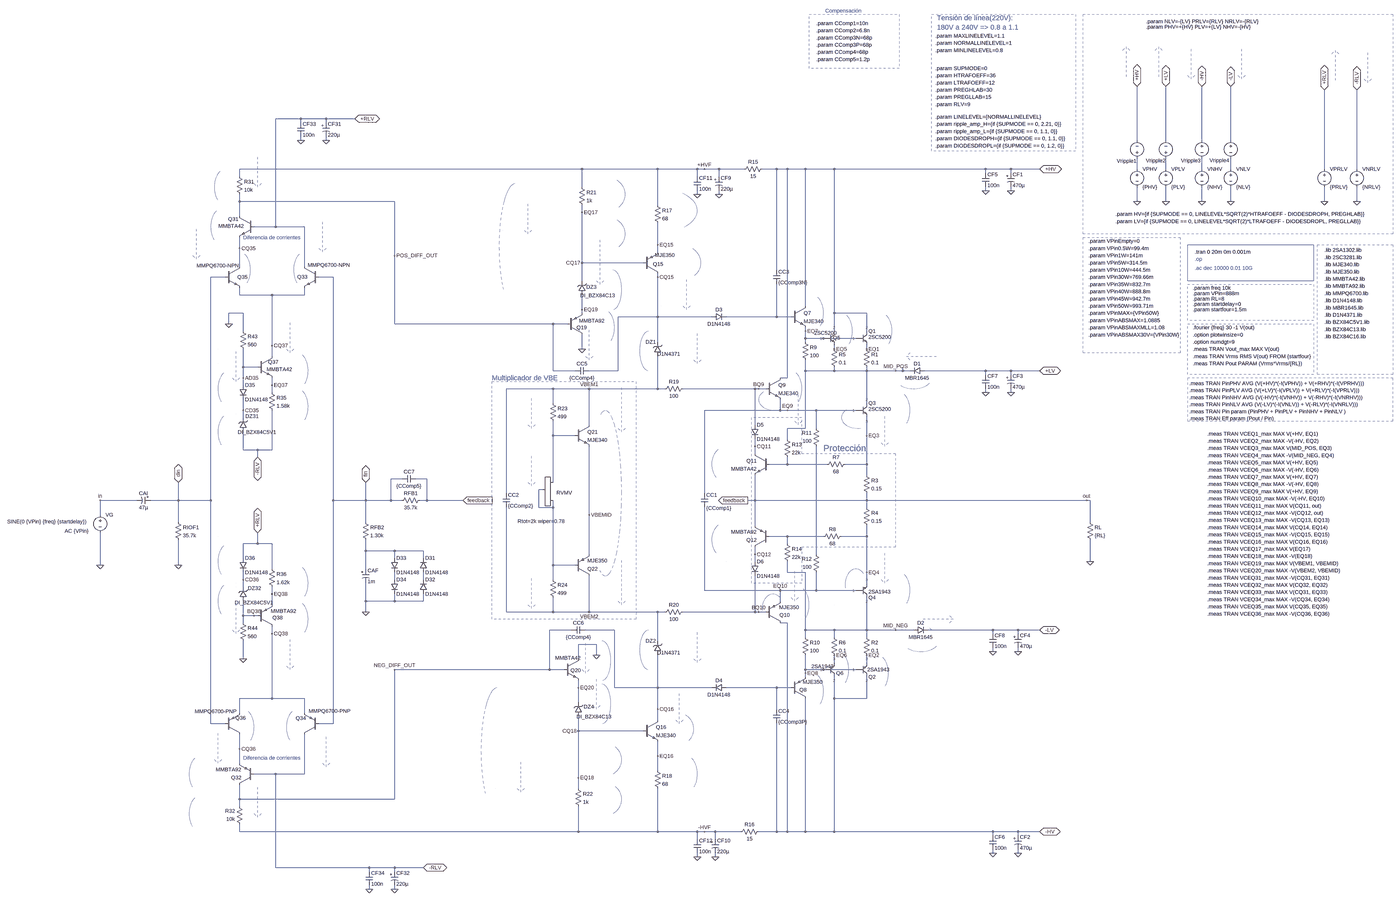
[diagram p0: schematic amplifier_V2.0c.asc, whole sheet]
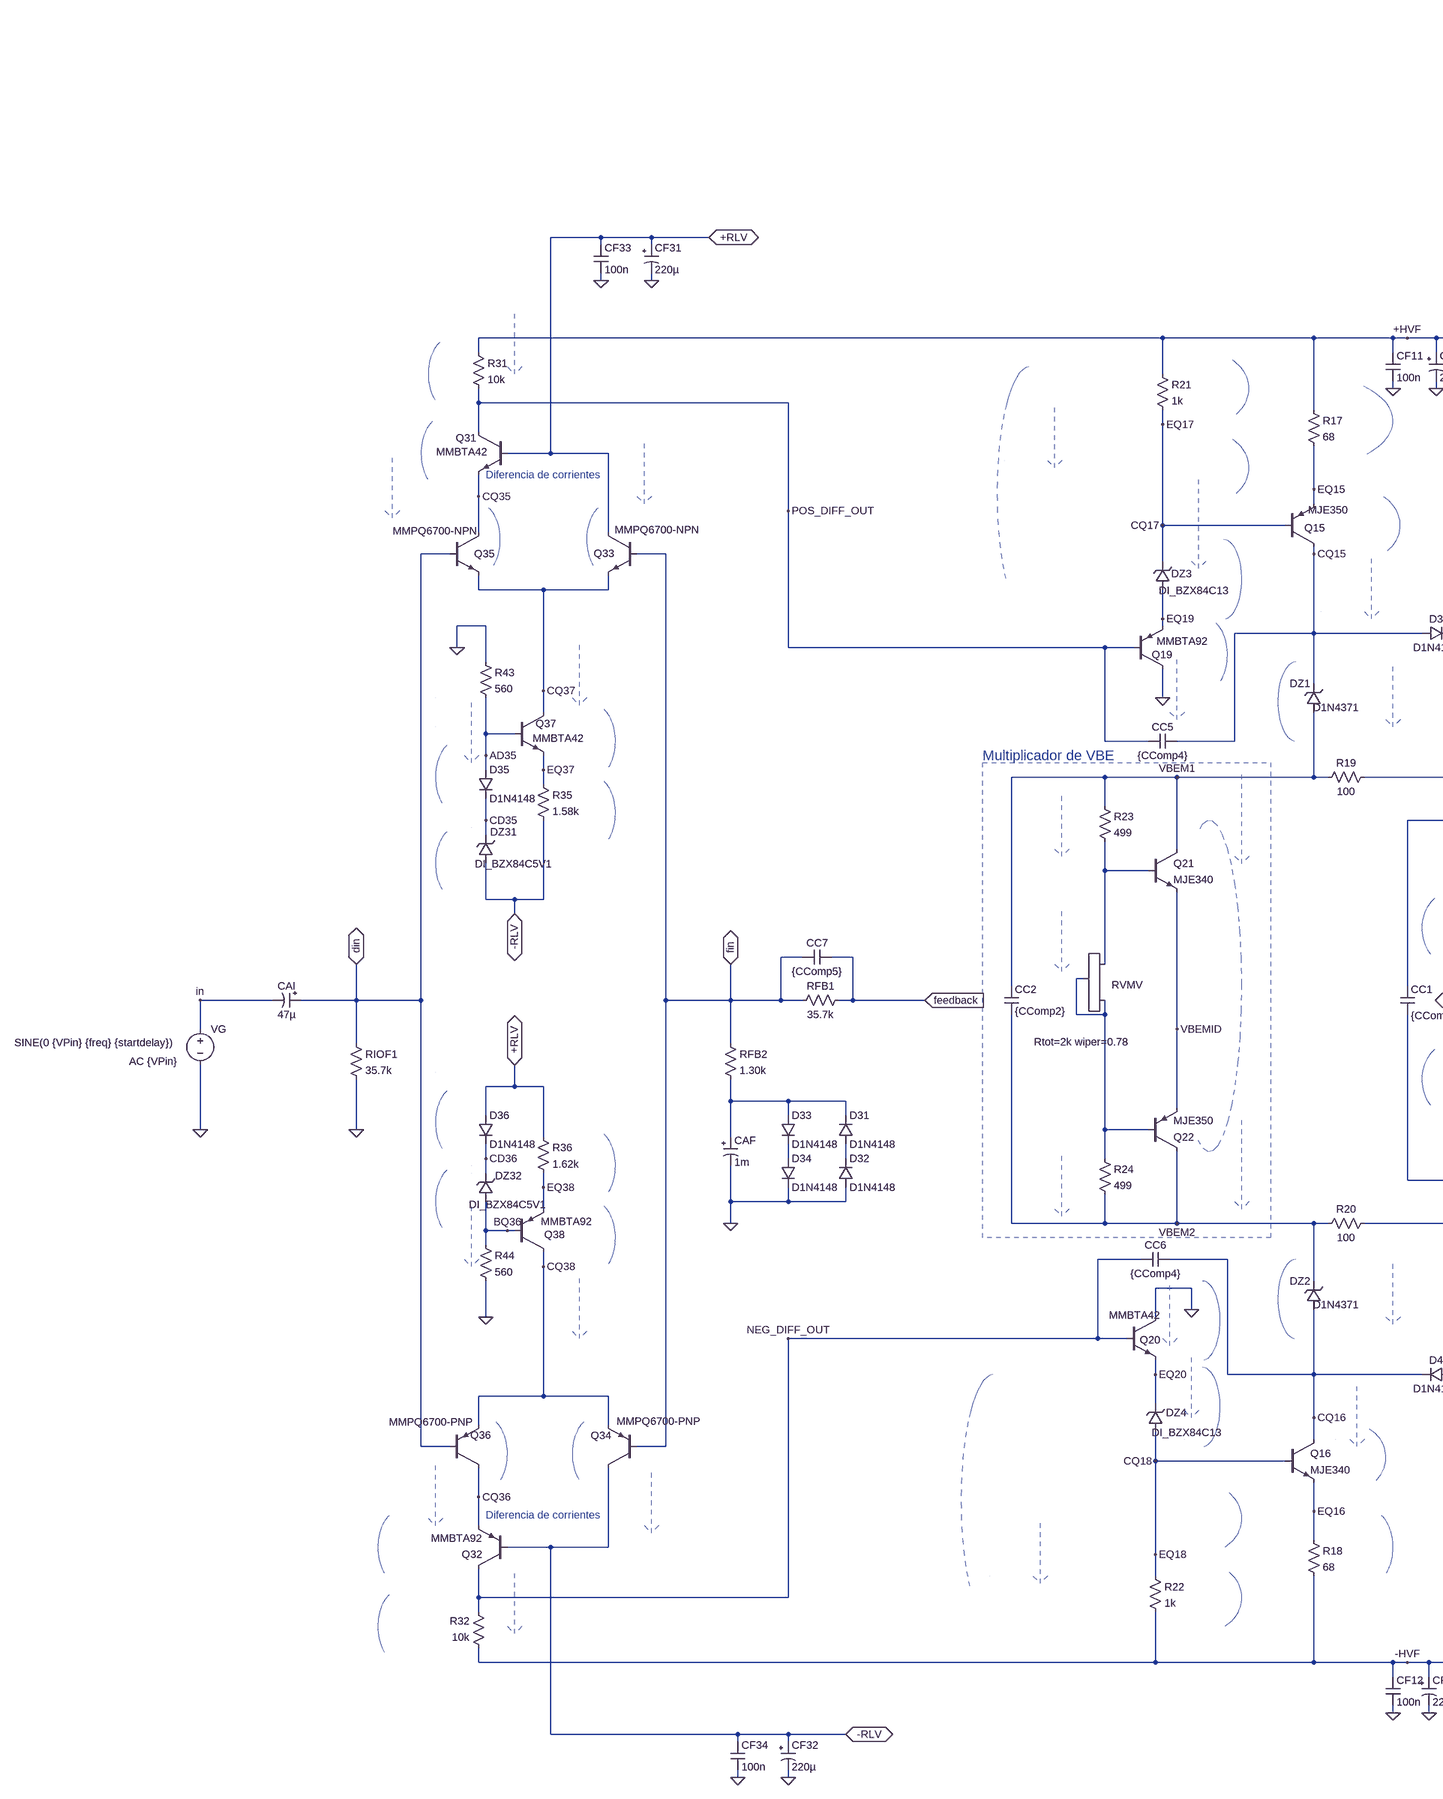
[diagram p1: schematic amplifier_V2.0c.asc, part, row 1 of 1, column 1 of 2]
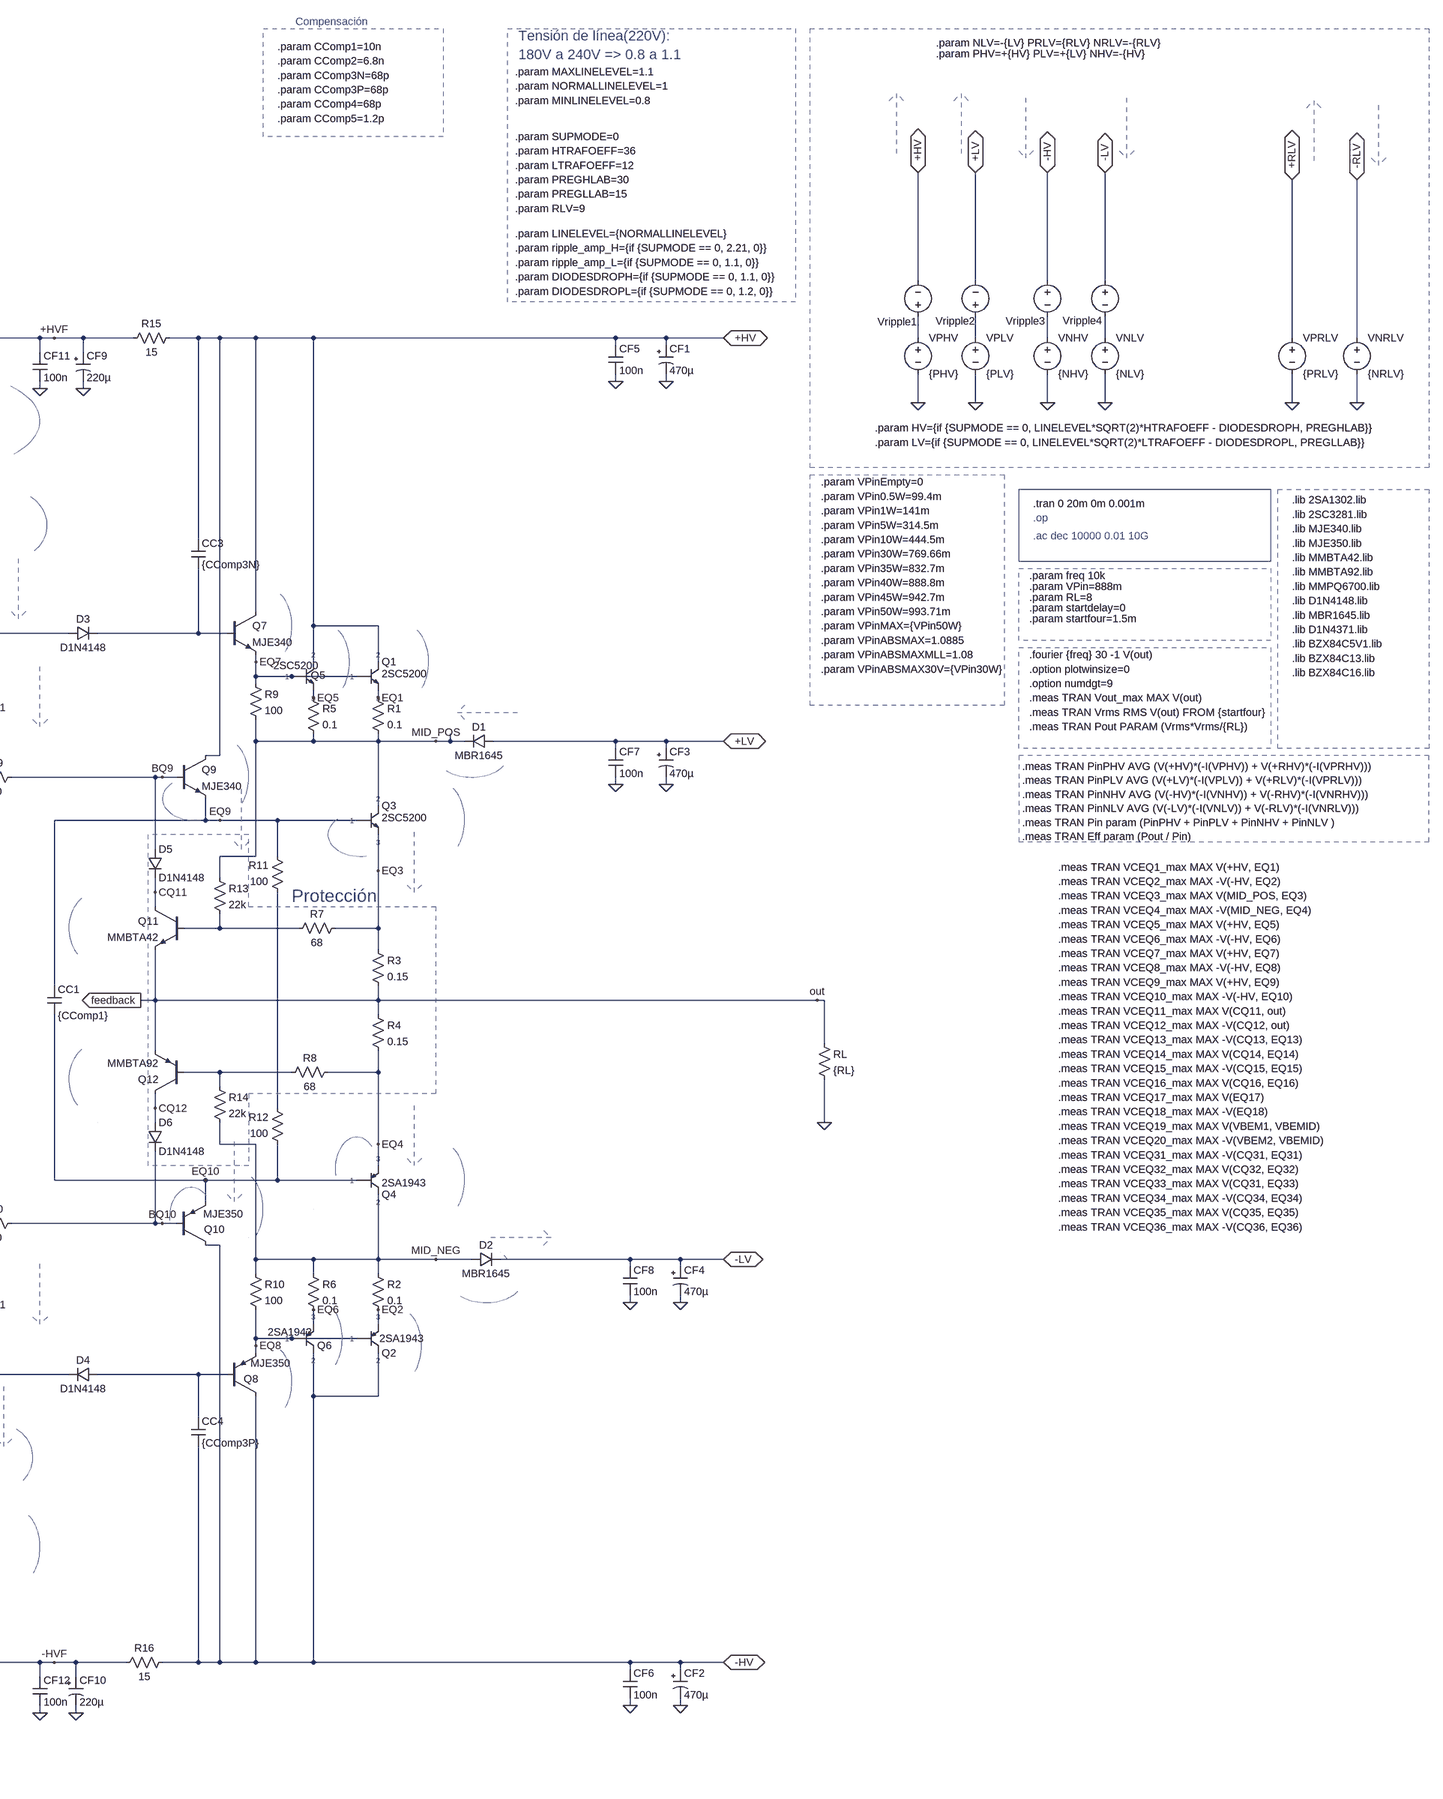
[diagram p2: schematic amplifier_V2.0c.asc, part, row 1 of 1, column 2 of 2]
amplifier_V2.0c.asc, the LTspice schematic file:
Version 4
SHEET 1 4212 2620
WIRE -1888 -1568 -2000 -1568
WIRE -1776 -1568 -1888 -1568
WIRE -1648 -1568 -1776 -1568
WIRE -1888 -1552 -1888 -1568
WIRE -1776 -1552 -1776 -1568
WIRE -1888 -1472 -1888 -1488
WIRE -1776 -1472 -1776 -1488
WIRE 1824 -1472 1824 -1712
WIRE 1952 -1472 1952 -1712
WIRE 2112 -1472 2112 -1712
WIRE 2240 -1472 2240 -1712
WIRE -640 -1344 -2160 -1344
WIRE -304 -1344 -640 -1344
WIRE -128 -1344 -304 -1344
WIRE -96 -1344 -128 -1344
WIRE -32 -1344 -96 -1344
WIRE 80 -1344 -32 -1344
WIRE 224 -1344 160 -1344
WIRE 272 -1344 224 -1344
WIRE 352 -1344 272 -1344
WIRE 480 -1344 352 -1344
WIRE 1152 -1344 480 -1344
WIRE 1264 -1344 1152 -1344
WIRE 1392 -1344 1264 -1344
WIRE 1824 -1344 1824 -1392
WIRE 1952 -1344 1952 -1392
WIRE 2112 -1344 2112 -1392
WIRE 2240 -1344 2240 -1392
WIRE 2656 -1344 2656 -1696
WIRE 2800 -1344 2800 -1696
WIRE 1152 -1328 1152 -1344
WIRE 1264 -1328 1264 -1344
WIRE -2160 -1312 -2160 -1344
WIRE -128 -1312 -128 -1344
WIRE -32 -1312 -32 -1344
WIRE -640 -1264 -640 -1344
WIRE 1152 -1248 1152 -1264
WIRE 1264 -1248 1264 -1264
WIRE -128 -1232 -128 -1248
WIRE -32 -1232 -32 -1248
WIRE -2160 -1200 -2160 -1232
WIRE -1472 -1200 -2160 -1200
WIRE 1824 -1200 1824 -1264
WIRE 1952 -1200 1952 -1264
WIRE 2112 -1200 2112 -1264
WIRE 2240 -1200 2240 -1264
WIRE 2656 -1200 2656 -1264
WIRE 2800 -1200 2800 -1264
WIRE -304 -1184 -304 -1344
WIRE -640 -1152 -640 -1184
WIRE -2160 -1136 -2160 -1200
WIRE -2000 -1088 -2000 -1568
WIRE -2000 -1088 -2096 -1088
WIRE -1872 -1088 -2000 -1088
WIRE -304 -1008 -304 -1104
WIRE -2160 -992 -2160 -1040
WIRE -304 -976 -304 -1008
WIRE -1472 -960 -1472 -1200
WIRE -640 -928 -640 -1152
WIRE -368 -928 -640 -928
WIRE -2160 -912 -2160 -992
WIRE -1872 -912 -1872 -1088
WIRE 224 -896 224 -1344
WIRE -2224 -864 -2288 -864
WIRE -1744 -864 -1808 -864
WIRE -304 -864 -304 -880
WIRE -640 -848 -640 -928
WIRE -2160 -784 -2160 -816
WIRE -2016 -784 -2160 -784
WIRE -1872 -784 -1872 -816
WIRE -1872 -784 -2016 -784
WIRE 352 -736 352 -1344
WIRE -640 -720 -640 -784
WIRE -2144 -704 -2208 -704
WIRE -640 -704 -640 -720
WIRE 480 -704 480 -1344
WIRE 624 -704 480 -704
WIRE -304 -688 -304 -864
WIRE -304 -688 -480 -688
WIRE -64 -688 -304 -688
WIRE 224 -688 224 -832
WIRE 224 -688 0 -688
WIRE 288 -688 224 -688
WIRE -2208 -656 -2208 -704
WIRE -1472 -656 -1472 -960
WIRE -768 -656 -1472 -656
WIRE -704 -656 -768 -656
WIRE -2144 -624 -2144 -704
WIRE 352 -624 352 -640
WIRE 480 -624 480 -704
WIRE 624 -624 624 -704
WIRE 352 -592 352 -624
WIRE 432 -592 352 -592
WIRE 576 -592 432 -592
WIRE -304 -576 -304 -688
WIRE 352 -576 352 -592
WIRE -2016 -560 -2016 -784
WIRE -640 -544 -640 -608
WIRE 480 -544 480 -560
WIRE 624 -544 624 -560
WIRE -2016 -512 -2016 -560
WIRE -2144 -464 -2144 -544
WIRE -2080 -464 -2144 -464
WIRE -768 -448 -768 -656
WIRE -672 -448 -768 -448
WIRE -480 -448 -480 -688
WIRE -480 -448 -608 -448
WIRE 352 -448 352 -496
WIRE 480 -448 480 -464
WIRE 480 -448 352 -448
WIRE 624 -448 624 -464
WIRE 624 -448 480 -448
WIRE 752 -448 624 -448
WIRE 784 -448 784 -464
WIRE 784 -448 752 -448
WIRE 816 -448 784 -448
WIRE 1152 -448 880 -448
WIRE 1264 -448 1152 -448
WIRE 1392 -448 1264 -448
WIRE 1152 -432 1152 -448
WIRE 1264 -432 1264 -448
WIRE -2144 -416 -2144 -464
WIRE 272 -416 272 -1344
WIRE 272 -416 240 -416
WIRE -2144 -384 -2144 -416
WIRE -2016 -384 -2016 -416
WIRE -768 -368 -976 -368
WIRE -608 -368 -768 -368
WIRE -304 -368 -304 -512
WIRE -304 -368 -608 -368
WIRE -272 -368 -304 -368
WIRE 128 -368 -192 -368
WIRE 144 -368 128 -368
WIRE 176 -368 144 -368
WIRE -2016 -352 -2016 -384
WIRE 1152 -352 1152 -368
WIRE 1264 -352 1264 -368
WIRE -768 -304 -768 -368
WIRE 624 -304 624 -448
WIRE -2144 -272 -2144 -320
WIRE 240 -272 240 -320
WIRE 240 -272 -96 -272
WIRE 272 -272 240 -272
WIRE 400 -272 272 -272
WIRE 576 -272 400 -272
WIRE -2144 -240 -2144 -272
WIRE -608 -208 -608 -368
WIRE 128 -208 128 -368
WIRE 352 -192 352 -448
WIRE 352 -192 272 -192
WIRE 400 -192 400 -272
WIRE -768 -160 -768 -224
WIRE -672 -160 -768 -160
WIRE 624 -160 624 -240
WIRE 272 -144 272 -192
WIRE 128 -112 128 -144
WIRE -2144 -96 -2144 -176
WIRE -2080 -96 -2144 -96
WIRE -2016 -96 -2016 -272
WIRE -2016 -96 -2080 -96
WIRE 128 -80 128 -112
WIRE -2080 -64 -2080 -96
WIRE 272 -32 272 -64
WIRE 272 -32 192 -32
WIRE 448 -32 272 -32
WIRE 624 -32 624 -160
WIRE 624 -32 528 -32
WIRE 624 16 624 -32
WIRE -1440 32 -1488 32
WIRE -1328 32 -1376 32
WIRE -768 48 -768 -160
WIRE -816 80 -832 80
WIRE -976 96 -976 -368
WIRE -96 96 -96 -272
WIRE -2640 128 -2912 128
WIRE -2432 128 -2432 48
WIRE -2432 128 -2576 128
WIRE -2288 128 -2288 -864
WIRE -2288 128 -2432 128
WIRE -1744 128 -1744 -864
WIRE -1600 128 -1600 48
WIRE -1600 128 -1744 128
WIRE -1488 128 -1488 32
WIRE -1488 128 -1600 128
WIRE -1440 128 -1488 128
WIRE -1328 128 -1328 32
WIRE -1328 128 -1360 128
WIRE -1168 128 -1328 128
WIRE 128 128 128 16
WIRE 128 128 96 128
WIRE 624 128 624 96
WIRE 624 128 128 128
WIRE 1600 128 624 128
WIRE 1616 128 1600 128
WIRE -832 160 -832 80
WIRE -768 160 -768 128
WIRE -768 160 -832 160
WIRE 624 160 624 128
WIRE -2912 192 -2912 128
WIRE -608 192 -608 -112
WIRE -2432 224 -2432 128
WIRE -1600 224 -1600 128
WIRE 1616 224 1616 128
WIRE 128 240 128 128
WIRE 272 288 192 288
WIRE 432 288 272 288
WIRE 624 288 624 240
WIRE 624 288 512 288
WIRE -2080 320 -2080 272
WIRE -2080 320 -2144 320
WIRE -2016 320 -2080 320
WIRE 272 320 272 288
WIRE -1600 352 -1600 304
WIRE -1472 352 -1600 352
WIRE -1344 352 -1472 352
WIRE -608 368 -608 192
WIRE 128 368 128 336
WIRE 400 368 400 -112
WIRE -2144 384 -2144 320
WIRE -1472 384 -1472 352
WIRE -1344 384 -1344 352
WIRE 128 400 128 368
WIRE 1616 400 1616 304
WIRE -2912 416 -2912 272
WIRE -2432 416 -2432 304
WIRE -768 416 -768 160
WIRE -672 416 -768 416
WIRE -2016 432 -2016 320
WIRE -1600 432 -1600 352
WIRE 272 448 272 400
WIRE 352 448 272 448
WIRE 624 448 624 288
WIRE -2144 480 -2144 448
WIRE -1472 480 -1472 448
WIRE -1344 480 -1344 448
WIRE -768 480 -768 416
WIRE 624 496 624 448
WIRE -2144 512 -2144 480
WIRE -96 528 -96 160
WIRE 240 528 -96 528
WIRE 400 528 400 448
WIRE 400 528 240 528
WIRE 576 528 400 528
WIRE -2016 544 -2016 512
WIRE -1600 576 -1600 496
WIRE -1472 576 -1472 544
WIRE -1472 576 -1600 576
WIRE -1344 576 -1344 544
WIRE -1344 576 -1472 576
WIRE 240 576 240 528
WIRE -2016 592 -2016 544
WIRE -1600 624 -1600 576
WIRE -976 624 -976 160
WIRE -768 624 -768 560
WIRE -768 624 -976 624
WIRE -608 624 -608 464
WIRE -608 624 -768 624
WIRE -304 624 -608 624
WIRE -272 624 -304 624
WIRE 128 624 128 464
WIRE 128 624 -192 624
WIRE 144 624 128 624
WIRE 176 624 144 624
WIRE -2144 640 -2144 576
WIRE -2096 640 -2144 640
WIRE -2080 640 -2096 640
WIRE -2144 672 -2144 640
WIRE 272 672 240 672
WIRE -688 704 -784 704
WIRE -496 704 -624 704
WIRE 352 704 352 448
WIRE 480 704 352 704
WIRE 624 704 624 560
WIRE 624 704 480 704
WIRE 752 704 624 704
WIRE 832 704 752 704
WIRE 1184 704 896 704
WIRE 1296 704 1184 704
WIRE 1392 704 1296 704
WIRE -2016 720 -2016 688
WIRE 1184 720 1184 704
WIRE 1296 720 1296 704
WIRE 352 736 352 704
WIRE 480 736 480 704
WIRE 624 736 624 704
WIRE -304 752 -304 624
WIRE -576 768 -656 768
WIRE 1184 800 1184 784
WIRE 1296 800 1296 784
WIRE -576 816 -576 768
WIRE -2144 832 -2144 752
WIRE -656 832 -656 768
WIRE 480 848 480 816
WIRE 624 848 624 816
WIRE -784 880 -784 704
WIRE -784 880 -1472 880
WIRE -720 880 -784 880
WIRE 352 880 352 816
WIRE 432 880 352 880
WIRE 576 880 432 880
WIRE 352 896 352 880
WIRE 352 912 352 896
WIRE -656 960 -656 928
WIRE -496 960 -496 704
WIRE -304 960 -304 816
WIRE -304 960 -496 960
WIRE -64 960 -304 960
WIRE 224 960 0 960
WIRE 288 960 224 960
WIRE -2016 1008 -2016 720
WIRE -2016 1008 -2160 1008
WIRE -1872 1008 -2016 1008
WIRE 480 1008 480 912
WIRE 624 1008 624 912
WIRE 624 1008 480 1008
WIRE -656 1024 -656 960
WIRE -304 1056 -304 960
WIRE 224 1056 224 960
WIRE -2160 1072 -2160 1008
WIRE -1872 1072 -1872 1008
WIRE -304 1104 -304 1056
WIRE -2288 1120 -2288 128
WIRE -2224 1120 -2288 1120
WIRE -1744 1120 -1744 128
WIRE -1744 1120 -1808 1120
WIRE -656 1152 -656 1088
WIRE -368 1152 -656 1152
WIRE -2160 1232 -2160 1168
WIRE -304 1264 -304 1200
WIRE -2160 1296 -2160 1232
WIRE -304 1328 -304 1264
WIRE -2000 1344 -2096 1344
WIRE -1872 1344 -1872 1168
WIRE -1872 1344 -2000 1344
WIRE -656 1360 -656 1152
WIRE -656 1408 -656 1360
WIRE -2160 1456 -2160 1392
WIRE -1472 1456 -1472 880
WIRE -1472 1456 -2160 1456
WIRE -2160 1488 -2160 1456
WIRE -2160 1600 -2160 1568
WIRE -656 1600 -656 1488
WIRE -656 1600 -2160 1600
WIRE -304 1600 -304 1408
WIRE -304 1600 -656 1600
WIRE -128 1600 -304 1600
WIRE -96 1600 -128 1600
WIRE -48 1600 -96 1600
WIRE 64 1600 -48 1600
WIRE 224 1600 224 1120
WIRE 224 1600 144 1600
WIRE 272 1600 272 672
WIRE 272 1600 224 1600
WIRE 352 1600 352 1008
WIRE 352 1600 272 1600
WIRE 480 1600 480 1008
WIRE 480 1600 352 1600
WIRE 1184 1600 480 1600
WIRE 1296 1600 1184 1600
WIRE 1392 1600 1296 1600
WIRE 1184 1616 1184 1600
WIRE 1296 1616 1296 1600
WIRE -128 1632 -128 1600
WIRE -48 1632 -48 1600
WIRE 1184 1696 1184 1680
WIRE 1296 1696 1296 1680
WIRE -128 1712 -128 1696
WIRE -48 1712 -48 1696
WIRE -2000 1760 -2000 1344
WIRE -1584 1760 -2000 1760
WIRE -1472 1760 -1584 1760
WIRE -1344 1760 -1472 1760
WIRE -1584 1776 -1584 1760
WIRE -1472 1776 -1472 1760
WIRE -1584 1856 -1584 1840
WIRE -1472 1856 -1472 1840
FLAG -608 -368 VBEM1
FLAG -608 624 VBEM2
FLAG 752 704 MID_NEG
FLAG 752 -448 MID_POS
FLAG -2432 416 0
FLAG -1600 624 0
FLAG -1648 -1568 +RLV
IOPIN -1648 -1568 BiDir
FLAG -1344 1760 -RLV
IOPIN -1344 1760 BiDir
FLAG -2080 -64 -RLV
IOPIN -2080 -64 BiDir
FLAG -2080 272 +RLV
IOPIN -2080 272 BiDir
FLAG 1392 1600 -HV
IOPIN 1392 1600 BiDir
FLAG 1392 704 -LV
IOPIN 1392 704 BiDir
FLAG 1392 -1344 +HV
IOPIN 1392 -1344 BiDir
FLAG 1392 -448 +LV
IOPIN 1392 -448 BiDir
FLAG 1616 400 0
FLAG 1600 128 out
FLAG -1168 128 feedback
IOPIN -1168 128 In
FLAG 96 128 feedback
IOPIN 96 128 Out
FLAG -2912 416 0
FLAG -2912 128 in
FLAG 1264 -1248 0
FLAG -640 -544 0
FLAG -576 816 0
FLAG -2144 832 0
FLAG -2208 -656 0
FLAG -1472 -960 POS_DIFF_OUT
FLAG -1472 880 NEG_DIFF_OUT
FLAG 1152 -1248 0
FLAG 1264 -352 0
FLAG 1152 -352 0
FLAG 1296 800 0
FLAG 1184 800 0
FLAG 1296 1696 0
FLAG 1184 1696 0
FLAG -1776 -1472 0
FLAG -1888 -1472 0
FLAG -1472 1856 0
FLAG -1584 1856 0
FLAG 1824 -1200 0
FLAG 1952 -1200 0
FLAG 2112 -1200 0
FLAG 2240 -1200 0
FLAG 1824 -1712 +HV
IOPIN 1824 -1712 BiDir
FLAG 1952 -1712 +LV
IOPIN 1952 -1712 BiDir
FLAG 2112 -1712 -HV
IOPIN 2112 -1712 BiDir
FLAG 2240 -1712 -LV
IOPIN 2240 -1712 BiDir
FLAG 2656 -1200 0
FLAG 2656 -1696 +RLV
IOPIN 2656 -1696 BiDir
FLAG 2800 -1200 0
FLAG 2800 -1696 -RLV
IOPIN 2800 -1696 BiDir
FLAG -2016 -560 CQ37
FLAG -2016 -384 EQ37
FLAG -2016 720 CQ38
FLAG -2016 544 EQ38
FLAG -2144 -272 CD35
FLAG -2144 -416 AD35
FLAG -2144 480 CD36
FLAG -2096 640 BQ36
FLAG -304 1264 EQ16
FLAG -656 960 EQ20
FLAG -304 1056 CQ16
FLAG -640 -720 EQ19
FLAG -304 -864 CQ15
FLAG -304 -1008 EQ15
FLAG 272 -272 EQ9
FLAG 624 448 EQ4
FLAG 624 -160 EQ3
FLAG 240 528 EQ10
FLAG 144 624 BQ10
FLAG 144 -368 BQ9
FLAG 480 816 EQ6
FLAG 624 816 EQ2
FLAG 624 -544 EQ1
FLAG 480 -544 EQ5
FLAG 352 -624 EQ7
FLAG 352 896 EQ8
FLAG 128 -112 CQ11
FLAG 128 368 CQ12
FLAG -2432 48 din
IOPIN -2432 48 BiDir
FLAG -1600 48 fin
IOPIN -1600 48 BiDir
FLAG -608 192 VBEMID
FLAG -2160 1232 CQ36
FLAG -2160 -992 CQ35
FLAG -656 1152 CQ18
FLAG -640 -928 CQ17
FLAG -656 1360 EQ18
FLAG -640 -1152 EQ17
FLAG -32 -1232 0
FLAG -48 1712 0
FLAG -96 -1344 +HVF
FLAG -96 1600 -HVF
FLAG -128 -1232 0
FLAG -128 1712 0
DATAFLAG 400 704 "round($*100)/100"
DATAFLAG -464 128 "V(vbem1)-V(vbem2)"
DATAFLAG -384 -496 "V(CQ15)-V(vbem1)"
DATAFLAG 160 -288 "V(BQ9)-V(EQ9)"
DATAFLAG 160 576 "V(EQ10)-V(BQ10)"
DATAFLAG -464 624 ""
DATAFLAG -464 -368 ""
DATAFLAG -944 -656 ""
DATAFLAG -1008 880 ""
DATAFLAG -416 -688 ""
DATAFLAG -2016 -688 ""
DATAFLAG -2016 896 ""
DATAFLAG -1872 -1008 ""
DATAFLAG 1504 128 ""
DATAFLAG -1696 128 ""
DATAFLAG -464 -832 "V(CQ17)-V(EQ19)"
DATAFLAG 352 -592 ""
DATAFLAG -368 960 ""
DATAFLAG 224 960 ""
DATAFLAG -608 0 ""
DATAFLAG -1248 128 ""
DATAFLAG 1328 -448 ""
DATAFLAG 1328 -1344 ""
DATAFLAG 1328 704 ""
DATAFLAG -2096 -96 ""
DATAFLAG -2032 320 ""
DATAFLAG -512 1056 "V(EQ20)-V(CQ18)"
DATAFLAG -384 832 "V(vbem2)-V(CQ16)"
DATAFLAG -2320 128 ""
DATAFLAG 1312 1600 ""
DATAFLAG -1680 -1568 ""
DATAFLAG -1376 1760 ""
DATAFLAG -176 -800 "-Ic(Q15)"
DATAFLAG 320 -240 "-Ie(Q9)"
DATAFLAG -464 -272 "Ic(Q21)"
DATAFLAG -464 496 "-Ic(Q20)"
DATAFLAG -768 -160 ""
DATAFLAG -768 416 ""
DATAFLAG 400 48 ""
DATAFLAG 224 128 ""
DATAFLAG 704 -208 "-Ix(Q3:3)"
DATAFLAG -608 -592 "-Ic(Q19)"
DATAFLAG -624 800 "Ic(Q18)"
DATAFLAG -576 960 "-Ie(Q18)"
DATAFLAG -1792 -1072 "Ic(Q33)"
DATAFLAG -2352 -1040 "Ic(Q35)"
DATAFLAG -2176 -496 "I(D35)"
DATAFLAG -2176 624 "I(D36)"
DATAFLAG -1936 -624 "Ic(Q37)"
DATAFLAG -1936 784 "-Ic(Q38)"
DATAFLAG -2256 1200 "-Ic(Q36)"
DATAFLAG 704 400 "Ix(Q4:3)"
DATAFLAG -208 1024 "Ic(Q16)"
DATAFLAG 304 480 "Ie(Q10)"
DATAFLAG 896 -512 "I(D1)"
DATAFLAG 912 656 "I(D2)"
DATAFLAG 1776 -1792 "-I(Vphv)"
DATAFLAG 1920 -1840 "-I(Vplv)"
DATAFLAG 2064 -1792 "I(vnhv)"
DATAFLAG 2848 -1824 "I(Vnrlv)"
DATAFLAG 2704 -1824 "-I(Vprlv)"
DATAFLAG 2288 -1840 "I(Vnlv)"
DATAFLAG -2288 -1088 "V(POS_DIFF_OUT)-V(CQ35)"
DATAFLAG -2112 -896 "V(CQ35)-V(CQ37)"
DATAFLAG -1920 -896 "V(+rlv)-V(CQ37)"
DATAFLAG -1856 -448 "V(CQ37)-V(EQ37)"
DATAFLAG -1856 656 "V(EQ38)-V(CQ38)"
DATAFLAG -2256 -176 "V(CD35)-V(-rlv)"
DATAFLAG -2256 -368 "V(AD35)-V(CD35)"
DATAFLAG -2256 400 "V(+rlv)-V(CD36)"
DATAFLAG -2256 576 "V(CD36)-V(BQ36)"
DATAFLAG -2096 1136 "-V(CQ36)+V(CQ38)"
DATAFLAG -1952 1136 "-V(-RLV)+V(CQ38)"
DATAFLAG -128 752 "-I(Dz2)"
DATAFLAG -144 1136 "V(CQ16)-V(EQ16)"
DATAFLAG -512 880 "-V(EQ20)"
DATAFLAG -128 -576 "-I(Dz1)"
DATAFLAG -496 -640 "V(EQ19)"
DATAFLAG -112 -928 "V(EQ15)-V(CQ15)"
DATAFLAG -864 -32 "Ix(RVMV:B)"
DATAFLAG -864 -288 "I(R21)"
DATAFLAG -864 512 "I(R22)"
DATAFLAG 336 -368 "V(+hv)-V(CQ13)"
DATAFLAG 816 -272 "V(MID_POS)-V(EQ3)"
DATAFLAG 816 528 "V(EQ4)-V(MID_NEG)"
DATAFLAG 368 592 "V(EQ10)-V(-hv)"
DATAFLAG 528 -208 "V(EQ9)-V(EQ3)"
DATAFLAG 528 464 "V(EQ4)-V(EQ10)"
DATAFLAG 720 912 "V(EQ2)-V(-hv)"
DATAFLAG 544 880 "V(EQ6)-V(-hv)"
DATAFLAG 736 -608 "V(+hv)-V(EQ1)"
DATAFLAG 560 -608 "V(+hv)-V(EQ5)"
DATAFLAG 432 -704 "V(+hv)-V(EQ7)"
DATAFLAG 432 976 "V(EQ8)-V(-hv)"
DATAFLAG -64 -32 "V(CQ11)-V(out)"
DATAFLAG -64 304 "V(out)-V(CQ12)"
DATAFLAG 864 800 "V(MID_NEG)-V(-lv)"
DATAFLAG 832 -368 "V(+lv)-V(MID_POS)"
DATAFLAG -448 -928 ""
DATAFLAG -448 1152 ""
DATAFLAG -128 -1152 "V(+HV)-V(eq15)"
DATAFLAG -128 1360 "V(EQ16)-V(-HV)"
DATAFLAG -560 -960 "-Ic(Q17)"
DATAFLAG -1856 -288 "V(EQ37)-V(-rlv)"
DATAFLAG -1856 496 "-V(EQ38)+V(+rlv)"
DATAFLAG -2384 1344 "V(CQ36)-V(NEG_DIFF_OUT)"
DATAFLAG -2384 1520 "V(NEG_DIFF_OUT)-V(-HV)"
DATAFLAG -2272 -1264 "V(+HV)-V(POS_DIFF_OUT)"
DATAFLAG -2016 -992 "Ic(Q35)-Ic(Q33)"
DATAFLAG -2016 1312 "Ic(Q36)-Ic(Q34)"
DATAFLAG -1776 1216 "-Ic(Q34)"
DATAFLAG -2080 -1360 "I(R31)"
DATAFLAG -2080 1440 "-I(R32)"
DATAFLAG -1008 -1008 "V(+hv)-V(POS_DIFF_OUT)"
DATAFLAG -1088 1232 "-V(-hv)+V(NEG_DIFF_OUT)"
DATAFLAG -1952 1344 ""
DATAFLAG -240 -1344 ""
DATAFLAG -240 1600 ""
DATAFLAG -880 -1136 "I(D9)"
DATAFLAG -912 1344 "I(D10)"
DATAFLAG -448 -1232 "V(+hv)-V(EQ17)"
DATAFLAG -448 -1056 "V(EQ17)-V(CQ17)"
DATAFLAG -464 1456 "-V(-hv)+V(EQ18)"
DATAFLAG -464 1280 "-V(EQ18)+V(CQ18)"
DATAFLAG -1696 -1344 ""
DATAFLAG -1664 1600 ""
SYMBOL npn 288 -736 R0
SYMATTR InstName Q7
SYMATTR Value MJE340
SYMBOL res 336 -592 R0
SYMATTR InstName R9
SYMATTR Value 100
SYMBOL diode -64 -672 R270
WINDOW 0 32 32 VTop 2
WINDOW 3 0 32 VBottom 2
SYMATTR InstName D3
SYMATTR Value D1N4148
SYMBOL npn 176 -416 R0
SYMATTR InstName Q9
SYMATTR Value MJE340
SYMBOL res 608 0 R0
SYMATTR InstName R3
SYMATTR Value 0.15
SYMBOL res 416 -96 R180
WINDOW 0 36 76 Left 2
WINDOW 3 36 40 Left 2
SYMATTR InstName R11
SYMATTR Value 100
SYMBOL res 608 144 R0
SYMATTR InstName R4
SYMATTR Value 0.15
SYMBOL pnp 176 672 M180
WINDOW 0 61 35 Left 2
WINDOW 3 59 69 Left 2
SYMATTR InstName Q10
SYMATTR Value MJE350
SYMBOL pnp 288 1008 M180
WINDOW 0 37 38 Left 2
WINDOW 3 52 73 Left 2
SYMATTR InstName Q8
SYMATTR Value MJE350
SYMBOL diode 0 944 R90
WINDOW 0 0 32 VBottom 2
WINDOW 3 32 32 VTop 2
SYMATTR InstName D4
SYMATTR Value D1N4148
SYMBOL diode 832 720 R270
WINDOW 0 32 32 VTop 2
WINDOW 3 0 32 VBottom 2
SYMATTR InstName D2
SYMATTR Value MBR1645
SYMBOL res 416 464 R180
WINDOW 0 36 76 Left 2
WINDOW 3 36 40 Left 2
SYMATTR InstName R12
SYMATTR Value 100
SYMBOL res 608 720 R0
SYMATTR InstName R2
SYMATTR Value 0.1
SYMBOL res 464 720 R0
SYMATTR InstName R6
SYMATTR Value 0.1
SYMBOL res 464 -560 R0
SYMATTR InstName R5
SYMATTR Value 0.1
SYMBOL res 608 -560 R0
SYMATTR InstName R1
SYMATTR Value 0.1
SYMBOL diode 880 -432 M270
WINDOW 0 32 32 VTop 2
WINDOW 3 0 32 VBottom 2
SYMATTR InstName D1
SYMATTR Value MBR1645
SYMBOL pnp -672 464 M180
SYMATTR InstName Q22
SYMATTR Value MJE350
SYMBOL npn -672 -208 R0
SYMATTR InstName Q21
SYMATTR Value MJE340
SYMBOL res -784 -320 R0
SYMATTR InstName R23
SYMATTR Value 499
SYMBOL res -784 464 R0
SYMATTR InstName R24
SYMATTR Value 499
SYMBOL res -176 -384 R90
WINDOW 0 0 56 VBottom 2
WINDOW 3 32 56 VTop 2
SYMATTR InstName R19
SYMATTR Value 100
SYMBOL res -176 608 R90
WINDOW 0 0 56 VBottom 2
WINDOW 3 32 56 VTop 2
SYMATTR InstName R20
SYMATTR Value 100
SYMBOL pnp -368 -880 M180
WINDOW 0 43 42 Left 2
WINDOW 3 51 82 Left 2
SYMATTR InstName Q15
SYMATTR Value MJE350
SYMBOL npn -368 1104 R0
SYMATTR InstName Q16
SYMATTR Value MJE340
SYMBOL npn -720 832 R0
WINDOW 0 29 51 Left 2
WINDOW 3 -39 -4 Left 2
SYMATTR InstName Q20
SYMATTR Value MMBTA42
SYMBOL res -1616 208 R0
SYMATTR InstName RFB2
SYMATTR Value 1.30k
SYMBOL res -1344 112 R90
WINDOW 0 0 56 VBottom 2
WINDOW 3 32 56 VTop 2
SYMATTR InstName RFB1
SYMATTR Value 35.7k
SYMBOL res -2448 208 R0
SYMATTR InstName RIOF1
SYMATTR Value 35.7k
SYMBOL pnp -704 -608 M180
WINDOW 0 40 32 Left 2
WINDOW 3 51 62 Left 2
SYMATTR InstName Q19
SYMATTR Value MMBTA92
SYMBOL npn -2224 -912 R0
WINDOW 3 -127 -3 Left 2
WINDOW 0 54 48 Left 2
SYMATTR Value MMPQ6700-NPN
SYMATTR InstName Q35
SYMBOL npn -1808 -912 M0
WINDOW 0 50 47 Left 2
WINDOW 3 -138 -6 Left 2
SYMATTR InstName Q33
SYMATTR Value MMPQ6700-NPN
SYMBOL pnp -2224 1168 M180
WINDOW 3 -135 102 Left 2
WINDOW 0 46 73 Left 2
SYMATTR Value MMPQ6700-PNP
SYMATTR InstName Q36
SYMBOL pnp -1808 1168 R180
WINDOW 0 57 72 Left 2
WINDOW 3 -141 104 Left 2
SYMATTR InstName Q34
SYMATTR Value MMPQ6700-PNP
SYMBOL cap -608 -464 R90
WINDOW 0 0 32 VBottom 2
WINDOW 3 32 32 VTop 2
SYMATTR InstName CC5
SYMATTR Value {CComp4}
SYMBOL cap -624 688 R90
WINDOW 0 0 32 VBottom 2
WINDOW 3 32 32 VTop 2
SYMATTR InstName CC6
SYMATTR Value {CComp4}
SYMBOL res -320 -1200 R0
SYMATTR InstName R17
SYMATTR Value 68
SYMBOL res -320 1312 R0
SYMATTR InstName R18
SYMATTR Value 68
SYMBOL 2SC5200 448 -608 R0
WINDOW 0 26 14 Left 2
WINDOW 3 -57 -8 Left 2
SYMATTR InstName Q5
SYMBOL 2SC5200 592 -608 R0
SYMATTR InstName Q1
SYMBOL 2SC5200 592 -288 R0
SYMATTR InstName Q3
SYMBOL 2SA1943 592 544 M180
SYMATTR InstName Q4
SYMBOL 2SA1943 448 896 M180
WINDOW 0 40 0 Left 2
WINDOW 3 -70 30 Left 2
SYMATTR InstName Q6
SYMBOL 2SA1943 592 896 M180
WINDOW 3 35 16 Left 2
SYMATTR InstName Q2
SYMBOL res -2160 -640 R0
SYMATTR InstName R43
SYMATTR Value 560
SYMBOL npn -2080 -512 R0
WINDOW 0 47 25 Left 2
WINDOW 3 40 58 Left 2
SYMATTR InstName Q37
SYMATTR Value MMBTA42
SYMBOL res -2032 -368 R0
SYMATTR InstName R35
SYMATTR Value 1.58k
SYMBOL pnp -2080 688 M180
WINDOW 0 66 39 Left 2
WINDOW 3 58 68 Left 2
SYMATTR InstName Q38
SYMATTR Value MMBTA92
SYMBOL res -2032 416 R0
SYMATTR InstName R36
SYMATTR Value 1.62k
SYMBOL res -2160 656 R0
SYMATTR InstName R44
SYMATTR Value 560
SYMBOL res 1600 208 R0
SYMATTR InstName RL
SYMATTR Value {RL}
SYMBOL cap 208 1056 R0
SYMATTR InstName CC4
SYMATTR Value {CComp3P}
SYMBOL cap 208 -896 R0
SYMATTR InstName CC3
SYMATTR Value {CComp3N}
SYMBOL voltage -2912 176 R0
WINDOW 3 -413 46 Left 2
WINDOW 123 -158 88 Left 2
WINDOW 39 0 0 Left 2
SYMATTR Value SINE(0 {VPin} {freq} {startdelay})
SYMATTR Value2 AC {VPin}
SYMATTR InstName VG
SYMBOL cap 1136 -1328 R0
SYMATTR InstName CF5
SYMATTR Value 100n
SYMBOL zener -2128 -176 R180
WINDOW 0 -53 70 Left 2
WINDOW 3 -131 -1 Left 2
SYMATTR InstName DZ31
SYMATTR Value DI_BZX84C5V1
SYMATTR Prefix X
SYMBOL zener -2128 576 R180
WINDOW 0 -64 58 Left 2
WINDOW 3 -117 -6 Left 2
SYMATTR InstName DZ32
SYMATTR Value DI_BZX84C5V1
SYMATTR Prefix X
SYMBOL cap -1376 16 R90
WINDOW 0 0 32 VBottom 2
WINDOW 3 32 32 VTop 2
SYMATTR InstName CC7
SYMATTR Value {CComp5}
SYMBOL potentiometer_standard -752 144 R180
WINDOW 3 -36 -77 Left 2
WINDOW 0 -68 50 Left 2
WINDOW 38 50 -51 Left 2
SYMATTR Value Rtot=2k wiper=0.78
SYMATTR InstName RVMV
SYMATTR SpiceLine ""
SYMBOL diode -2160 384 R0
SYMATTR InstName D36
SYMATTR Value D1N4148
SYMBOL diode -2160 -384 R0
SYMATTR InstName D35
SYMATTR Value D1N4148
SYMBOL pnp 192 336 R180
SYMATTR InstName Q12
SYMATTR Value MMBTA92
SYMBOL npn 192 -80 M0
SYMATTR InstName Q11
SYMATTR Value MMBTA42
SYMBOL diode 112 -208 R0
SYMATTR InstName D5
SYMATTR Value D1N4148
SYMBOL res 544 -48 R90
WINDOW 0 0 56 VBottom 2
WINDOW 3 32 56 VTop 2
SYMATTR InstName R7
SYMATTR Value 68
SYMBOL res 528 272 R90
WINDOW 0 0 56 VBottom 2
WINDOW 3 32 56 VTop 2
SYMATTR InstName R8
SYMATTR Value 68
SYMBOL diode 112 400 R0
SYMATTR InstName D6
SYMATTR Value D1N4148
SYMBOL res 256 -160 R0
SYMATTR InstName R13
SYMATTR Value 22k
SYMBOL res 256 304 R0
SYMATTR InstName R14
SYMATTR Value 22k
SYMBOL polcap 1248 -1328 R0
SYMATTR InstName CF1
SYMATTR Value 470µ
SYMBOL cap 1136 -432 R0
SYMATTR InstName CF7
SYMATTR Value 100n
SYMBOL polcap 1248 -432 R0
SYMATTR InstName CF3
SYMATTR Value 470µ
SYMBOL cap 1168 720 R0
SYMATTR InstName CF8
SYMATTR Value 100n
SYMBOL polcap 1280 720 R0
SYMATTR InstName CF4
SYMATTR Value 470µ
SYMBOL cap 1168 1616 R0
SYMATTR InstName CF6
SYMATTR Value 100n
SYMBOL polcap 1280 1616 R0
SYMATTR InstName CF2
SYMATTR Value 470µ
SYMBOL cap -1904 -1552 R0
SYMATTR InstName CF33
SYMATTR Value 100n
SYMBOL polcap -1792 -1552 R0
SYMATTR InstName CF31
SYMATTR Value 220µ
SYMBOL cap -1600 1776 R0
SYMATTR InstName CF34
SYMATTR Value 100n
SYMBOL polcap -1488 1776 R0
SYMATTR InstName CF32
SYMATTR Value 220µ
SYMBOL polcap -1616 432 R0
SYMATTR InstName CAF
SYMATTR Value 1m
SYMBOL diode -1488 384 R0
SYMATTR InstName D33
SYMATTR Value D1N4148
SYMBOL diode -1488 480 R0
SYMATTR InstName D34
SYMATTR Value D1N4148
SYMBOL diode -1360 544 M180
WINDOW 0 24 64 Left 2
WINDOW 3 24 0 Left 2
SYMATTR InstName D32
SYMATTR Value D1N4148
SYMBOL diode -1360 448 M180
WINDOW 0 24 64 Left 2
WINDOW 3 24 0 Left 2
SYMATTR InstName D31
SYMATTR Value D1N4148
SYMBOL polcap -2576 112 R90
WINDOW 0 0 32 VBottom 2
WINDOW 3 32 32 VTop 2
SYMATTR InstName CAI
SYMATTR Value 47µ
SYMBOL res 336 720 R0
SYMATTR InstName R10
SYMATTR Value 100
SYMBOL cap -992 96 R0
SYMATTR InstName CC2
SYMATTR Value {CComp2}
SYMBOL voltage 1824 -1360 R0
SYMATTR InstName VPHV
SYMATTR Value {PHV}
SYMBOL voltage 1952 -1360 R0
SYMATTR InstName VPLV
SYMATTR Value {PLV}
SYMBOL voltage 2112 -1360 R0
SYMATTR InstName VNHV
SYMATTR Value {NHV}
SYMBOL voltage 2240 -1360 R0
SYMATTR InstName VNLV
SYMATTR Value {NLV}
SYMBOL voltage 2656 -1360 R0
SYMATTR InstName VPRLV
SYMATTR Value {PRLV}
SYMBOL voltage 2800 -1360 R0
SYMATTR InstName VNRLV
SYMATTR Value {NRLV}
SYMBOL voltage 2240 -1488 R0
WINDOW 123 0 0 Left 0
WINDOW 39 0 0 Left 0
WINDOW 0 -94 105 Left 2
WINDOW 3 -94 77 Invisible 2
SYMATTR InstName Vripple4
SYMATTR Value PULSE({ripple_amp_L} 0 0 1m 9m 0 10m)
SYMBOL voltage 2112 -1488 R0
WINDOW 123 0 0 Left 0
WINDOW 39 0 0 Left 0
WINDOW 0 -93 106 Left 2
WINDOW 3 -93 78 Invisible 2
SYMATTR InstName Vripple3
SYMATTR Value PULSE({ripple_amp_H} 0 0 1m 9m 0 10m)
SYMBOL voltage 1824 -1376 R180
WINDOW 123 0 0 Left 0
WINDOW 39 0 0 Left 0
WINDOW 0 1 4 Left 2
WINDOW 3 1 -24 Invisible 2
SYMATTR InstName Vripple1
SYMATTR Value PULSE({ripple_amp_H} 0 0 1m 9m 0 10m)
SYMBOL voltage 1952 -1376 R180
WINDOW 123 0 0 Left 0
WINDOW 39 0 0 Left 0
WINDOW 0 0 6 Left 2
WINDOW 3 0 -22 Invisible 2
SYMATTR InstName Vripple2
SYMATTR Value PULSE({ripple_amp_H} 0 0 1m 9m 0 10m)
SYMBOL zener -288 -512 R180
WINDOW 0 24 64 Left 2
WINDOW 3 -84 11 Left 2
SYMATTR InstName DZ1
SYMATTR Value D1N4371
SYMBOL zener -288 816 R180
WINDOW 0 24 64 Left 2
WINDOW 3 -84 11 Left 2
SYMATTR InstName DZ2
SYMATTR Value D1N4371
SYMBOL cap -112 96 R0
WINDOW 3 24 66 Left 2
SYMATTR Value {CComp1}
SYMATTR InstName CC1
SYMBOL npn -2096 -1136 M0
WINDOW 0 69 14 Left 2
WINDOW 3 44 45 Left 2
SYMATTR InstName Q31
SYMATTR Value MMBTA42
SYMBOL res -2176 -1328 R0
SYMATTR InstName R31
SYMATTR Value 10k
SYMBOL pnp -2096 1392 R180
SYMATTR InstName Q32
SYMATTR Value MMBTA92
SYMBOL res -2144 1584 R180
WINDOW 0 36 76 Left 2
WINDOW 3 36 40 Left 2
SYMATTR InstName R32
SYMATTR Value 10k
SYMBOL zener -624 -784 R180
WINDOW 0 -49 36 Left 2
WINDOW 3 -131 -1 Left 2
SYMATTR InstName DZ3
SYMATTR Value DI_BZX84C13
SYMATTR Prefix X
SYMBOL zener -640 1088 R180
WINDOW 0 -53 43 Left 2
WINDOW 3 -131 -1 Left 2
SYMATTR InstName DZ4
SYMATTR Value DI_BZX84C13
SYMATTR Prefix X
SYMBOL res -656 -1280 R0
SYMATTR InstName R21
SYMATTR Value 1k
SYMBOL res -672 1392 R0
SYMATTR InstName R22
SYMATTR Value 1k
SYMBOL res 176 -1360 R90
WINDOW 0 0 56 VBottom 2
WINDOW 3 32 56 VTop 2
SYMATTR InstName R15
SYMATTR Value 15
SYMBOL polcap -48 -1312 R0
SYMATTR InstName CF9
SYMATTR Value 220µ
SYMBOL res 160 1584 R90
WINDOW 0 0 56 VBottom 2
WINDOW 3 32 56 VTop 2
SYMATTR InstName R16
SYMATTR Value 15
SYMBOL polcap -64 1632 R0
SYMATTR InstName CF10
SYMATTR Value 220µ
SYMBOL cap -144 -1312 R0
SYMATTR InstName CF11
SYMATTR Value 100n
SYMBOL cap -144 1632 R0
SYMATTR InstName CF12
SYMATTR Value 100n
TEXT 2080 -976 Left 2 !.tran 0 20m 0m 0.001m
TEXT 2072 -816 Left 2 !.param freq 10k
TEXT 2080 -944 Left 2 ;.op
TEXT 2072 -640 Left 2 !.fourier {freq} 30 -1 V(out)
TEXT 2656 -984 Left 2 !.lib 2SA1302.lib
TEXT 2656 -952 Left 2 !.lib 2SC3281.lib
TEXT 2656 -728 Left 2 !.lib MBR1645.lib
TEXT 2656 -920 Left 2 !.lib MJE340.lib
TEXT 2656 -888 Left 2 !.lib MJE350.lib
TEXT 2656 -760 Left 2 !.lib D1N4148.lib
TEXT 2080 -904 Left 2 ;.ac dec 10000 0.01 10G
TEXT 2072 -792 Left 2 !.param VPin=888m
TEXT 2656 -664 Left 2 !.lib BZX84C5V1.lib
TEXT 2656 -856 Left 2 !.lib MMBTA42.lib
TEXT 2656 -824 Left 2 !.lib MMBTA92.lib
TEXT 2656 -792 Left 2 !.lib MMPQ6700.lib
TEXT 2072 -608 Left 2 !.option plotwinsize=0
TEXT 2072 -512 Left 2 !.meas TRAN Vrms RMS V(out) FROM {startfour}
TEXT 2072 -480 Left 2 !.meas TRAN Pout PARAM (Vrms*Vrms/{RL})
TEXT 2072 -576 Left 2 !.option numdgt=9
TEXT 2072 -544 Left 2 !.meas TRAN Vout_max MAX V(out)
TEXT 2072 -768 Left 2 !.param RL=8
TEXT 2056 -392 Left 2 !.meas TRAN PinPHV AVG (V(+HV)*(-I(VPHV)) + V(+RHV)*(-I(VPRHV)))\n.meas TRAN PinPLV AVG (V(+LV)*(-I(VPLV)) + V(+RLV)*(-I(VPRLV)))\n.meas TRAN PinNHV AVG (V(-HV)*(-I(VNHV)) + V(-RHV)*(-I(VNRHV)))\n.meas TRAN PinNLV AVG (V(-LV)*(-I(VNLV)) + V(-RLV)*(-I(VNRLV)))\n.meas TRAN Pin param (PinPHV + PinPLV + PinNHV + PinNLV )\n.meas TRAN Eff param (Pout / Pin)
TEXT -1040 -416 Left 3 ;Multiplicador de VBE
TEXT 432 -104 Left 4 ;Protección
TEXT 400 -1992 Left 2 !.param CComp1=10n
TEXT 400 -1928 Left 2 !.param CComp3N=68p
TEXT 400 -1864 Left 2 !.param CComp4=68p
TEXT 440 -2048 Left 2 ;Compensación
TEXT 400 -1896 Left 2 !.param CComp3P=68p
TEXT 400 -1832 Left 2 !.param CComp5=1.2p
TEXT 1864 -1976 Left 2 !.param PHV=+{HV} PLV=+{LV} NHV=-{HV}
TEXT 1728 -1144 Left 2 !.param HV={if {SUPMODE == 0, LINELEVEL*SQRT(2)*HTRAFOEFF - DIODESDROPH, PREGHLAB}}
TEXT 1728 -1112 Left 2 !.param LV={if {SUPMODE == 0, LINELEVEL*SQRT(2)*LTRAFOEFF - DIODESDROPL, PREGLLAB}}
TEXT 928 -1632 Left 2 !.param RLV=9
TEXT 928 -1544 Left 2 !.param ripple_amp_H={if {SUPMODE == 0, 2.21, 0}}
TEXT 1864 -2000 Left 2 !.param NLV=-{LV} PRLV={RLV} NRLV=-{RLV}
TEXT 928 -1512 Left 2 !.param ripple_amp_L={if {SUPMODE == 0, 1.1, 0}}
TEXT 928 -1760 Left 2 !.param HTRAFOEFF=36
TEXT 928 -1728 Left 2 !.param LTRAFOEFF=12
TEXT 928 -1576 Left 2 !.param LINELEVEL={NORMALLINELEVEL}
TEXT 936 -2016 Left 3 ;Tensión de línea(220V):\n180V a 240V => 0.8 a 1.1
TEXT 928 -1480 Left 2 !.param DIODESDROPH={if {SUPMODE == 0, 1.1, 0}}
TEXT 928 -1936 Left 2 !.param MAXLINELEVEL=1.1
TEXT 928 -1872 Left 2 !.param MINLINELEVEL=0.8
TEXT 2656 -696 Left 2 !.lib D1N4371.lib
TEXT 400 -1960 Left 2 !.param CComp2=6.8n
TEXT 1608 -960 Left 2 !.param VPin1W=141m
TEXT 1608 -672 Left 2 !.param VPinABSMAX=1.0885
TEXT 1608 -928 Left 2 !.param VPin5W=314.5m
TEXT 1608 -896 Left 2 !.param VPin10W=444.5m
TEXT 1608 -768 Left 2 !.param VPin45W=942.7m
TEXT 1608 -736 Left 2 !.param VPin50W=993.71m
TEXT 1608 -864 Left 2 !.param VPin30W=769.66m
TEXT 1608 -992 Left 2 !.param VPin0.5W=99.4m
TEXT 1608 -704 Left 2 !.param VPinMAX={VPin50W}
TEXT 928 -1904 Left 2 !.param NORMALLINELEVEL=1
TEXT 928 -1448 Left 2 !.param DIODESDROPL={if {SUPMODE == 0, 1.2, 0}}
TEXT 2136 -168 Left 2 !.meas TRAN VCEQ1_max MAX V(+HV, EQ1)
TEXT 2136 -136 Left 2 !.meas TRAN VCEQ2_max MAX -V(-HV, EQ2)
TEXT 2136 -40 Left 2 !.meas TRAN VCEQ5_max MAX V(+HV, EQ5)
TEXT 2136 -8 Left 2 !.meas TRAN VCEQ6_max MAX -V(-HV, EQ6)
TEXT 2136 -104 Left 2 !.meas TRAN VCEQ3_max MAX V(MID_POS, EQ3)
TEXT 2136 -72 Left 2 !.meas TRAN VCEQ4_max MAX -V(MID_NEG, EQ4)
TEXT 2136 24 Left 2 !.meas TRAN VCEQ7_max MAX V(+HV, EQ7)
TEXT 2136 56 Left 2 !.meas TRAN VCEQ8_max MAX -V(-HV, EQ8)
TEXT 2136 88 Left 2 !.meas TRAN VCEQ9_max MAX V(+HV, EQ9)
TEXT 2136 120 Left 2 !.meas TRAN VCEQ10_max MAX -V(-HV, EQ10)
TEXT 2136 152 Left 2 !.meas TRAN VCEQ11_max MAX V(CQ11, out)
TEXT 2136 184 Left 2 !.meas TRAN VCEQ12_max MAX -V(CQ12, out)
TEXT 2136 216 Left 2 !.meas TRAN VCEQ13_max MAX -V(CQ13, EQ13)
TEXT 2136 248 Left 2 !.meas TRAN VCEQ14_max MAX V(CQ14, EQ14)
TEXT 2136 280 Left 2 !.meas TRAN VCEQ15_max MAX -V(CQ15, EQ15)
TEXT 2136 312 Left 2 !.meas TRAN VCEQ16_max MAX V(CQ16, EQ16)
TEXT 2136 344 Left 2 !.meas TRAN VCEQ17_max MAX V(EQ17)
TEXT 2136 376 Left 2 !.meas TRAN VCEQ18_max MAX -V(EQ18)
TEXT 2136 408 Left 2 !.meas TRAN VCEQ19_max MAX V(VBEM1, VBEMID)
TEXT 2136 440 Left 2 !.meas TRAN VCEQ20_max MAX -V(VBEM2, VBEMID)
TEXT 2136 472 Left 2 !.meas TRAN VCEQ31_max MAX -V(CQ31, EQ31)
TEXT 2136 504 Left 2 !.meas TRAN VCEQ32_max MAX V(CQ32, EQ32)
TEXT 2136 536 Left 2 !.meas TRAN VCEQ33_max MAX V(CQ31, EQ33)
TEXT 2136 568 Left 2 !.meas TRAN VCEQ34_max MAX -V(CQ34, EQ34)
TEXT 2136 600 Left 2 !.meas TRAN VCEQ35_max MAX V(CQ35, EQ35)
TEXT 2136 632 Left 2 !.meas TRAN VCEQ36_max MAX -V(CQ36, EQ36)
TEXT -2144 1272 Left 2 ;Diferencia de corrientes
TEXT -2144 -1040 Left 2 ;Diferencia de corrientes
TEXT 1608 -1024 Left 2 !.param VPinEmpty=0
TEXT 2656 -632 Left 2 !.lib BZX84C13.lib
TEXT 1608 -640 Left 2 !.param VPinABSMAXMLL=1.08
TEXT 1608 -608 Left 2 !.param VPinABSMAX30V={VPin30W}
TEXT 2656 -600 Left 2 !.lib BZX84C16.lib
TEXT 1608 -800 Left 2 !.param VPin40W=888.8m
TEXT 2072 -744 Left 2 !.param startdelay=0
TEXT 928 -1792 Left 2 !.param SUPMODE=0
TEXT 928 -1696 Left 2 !.param PREGHLAB=30
TEXT 928 -1664 Left 2 !.param PREGLLAB=15
TEXT 1608 -832 Left 2 !.param VPin35W=832.7m
TEXT 2072 -720 Left 2 !.param startfour=1.5m
LINE Normal -560 -832 -560 -1040 2
LINE Normal -560 -832 -560 -832 2
LINE Normal -560 -832 -560 -832 2
LINE Normal -576 -848 -560 -832 2
LINE Normal -576 -848 -576 -848 2
LINE Normal -544 -848 -560 -832 2
LINE Normal 336 496 112 496 2
LINE Normal 336 336 336 496 2
LINE Normal 752 336 336 336 2
LINE Normal 752 -80 752 336 2
LINE Normal 336 -80 752 -80 2
LINE Normal 112 -240 112 496 2
LINE Normal 336 -240 112 -240 2
LINE Normal 336 -80 336 -240 2
LINE Normal 336 -80 336 -80 2
LINE Normal -176 -720 -176 -720 2
LINE Normal -176 -720 -176 -720 2
LINE Normal -192 -736 -176 -720 2
LINE Normal -288 -736 -288 -736 2
LINE Normal 320 -208 320 -352 2
LINE Normal 320 -208 320 -208 2
LINE Normal 320 -208 320 -208 2
LINE Normal 304 -224 320 -208 2
LINE Normal 304 -224 304 -224 2
LINE Normal 336 -224 320 -208 2
LINE Normal -464 -176 -464 -384 2
LINE Normal -464 -176 -464 -176 2
LINE Normal -464 -176 -464 -176 2
LINE Normal -480 -192 -464 -176 2
LINE Normal -480 -192 -480 -192 2
LINE Normal -448 -192 -464 -176 2
LINE Normal -464 592 -464 384 2
LINE Normal -464 592 -464 592 2
LINE Normal -464 592 -464 592 2
LINE Normal -480 576 -464 592 2
LINE Normal -480 576 -480 576 2
LINE Normal -448 576 -464 592 2
LINE Normal 352 672 352 672 2
LINE Normal 352 672 352 672 2
LINE Normal 336 656 336 656 2
LINE Normal 704 -112 704 -256 2
LINE Normal 704 -112 704 -112 2
LINE Normal 704 -112 704 -112 2
LINE Normal 688 -128 704 -112 2
LINE Normal 688 -128 688 -128 2
LINE Normal 720 -128 704 -112 2
LINE Normal -608 -496 -608 -640 2
LINE Normal -608 -496 -608 -496 2
LINE Normal -608 -496 -608 -496 2
LINE Normal -624 -512 -608 -496 2
LINE Normal -624 -512 -624 -512 2
LINE Normal -592 -512 -608 -496 2
LINE Normal -624 896 -624 752 2
LINE Normal -624 896 -624 896 2
LINE Normal -624 896 -624 896 2
LINE Normal -640 880 -624 896 2
LINE Normal -640 880 -640 880 2
LINE Normal -608 880 -624 896 2
LINE Normal -576 1056 -576 912 2
LINE Normal -576 1056 -576 1056 2
LINE Normal -576 1056 -576 1056 2
LINE Normal -592 1040 -576 1056 2
LINE Normal -592 1040 -592 1040 2
LINE Normal -560 1040 -576 1056 2
LINE Normal -1792 -976 -1792 -1120 2
LINE Normal -1792 -976 -1792 -976 2
LINE Normal -1792 -976 -1792 -976 2
LINE Normal -1808 -992 -1792 -976 2
LINE Normal -1808 -992 -1808 -992 2
LINE Normal -1776 -992 -1792 -976 2
LINE Normal -2352 -944 -2352 -1088 2
LINE Normal -2352 -944 -2352 -944 2
LINE Normal -2352 -944 -2352 -944 2
LINE Normal -2368 -960 -2352 -944 2
LINE Normal -2368 -960 -2368 -960 2
LINE Normal -2336 -960 -2352 -944 2
LINE Normal -2176 -400 -2176 -544 2
LINE Normal -2176 -400 -2176 -400 2
LINE Normal -2176 -400 -2176 -400 2
LINE Normal -2192 -416 -2176 -400 2
LINE Normal -2192 -416 -2192 -416 2
LINE Normal -2160 -416 -2176 -400 2
LINE Normal -2176 720 -2176 576 2
LINE Normal -2176 720 -2176 720 2
LINE Normal -2176 720 -2176 720 2
LINE Normal -2192 704 -2176 720 2
LINE Normal -2192 704 -2192 704 2
LINE Normal -2160 704 -2176 720 2
LINE Normal -1936 -528 -1936 -672 2
LINE Normal -1936 -528 -1936 -528 2
LINE Normal -1936 -528 -1936 -528 2
LINE Normal -1952 -544 -1936 -528 2
LINE Normal -1952 -544 -1952 -544 2
LINE Normal -1920 -544 -1936 -528 2
LINE Normal -1936 880 -1936 736 2
LINE Normal -1936 880 -1936 880 2
LINE Normal -1936 880 -1936 880 2
LINE Normal -1952 864 -1936 880 2
LINE Normal -1952 864 -1952 864 2
LINE Normal -1920 864 -1936 880 2
LINE Normal -2256 1296 -2256 1152 2
LINE Normal -2256 1296 -2256 1296 2
LINE Normal -2256 1296 -2256 1296 2
LINE Normal -2272 1280 -2256 1296 2
LINE Normal -2272 1280 -2272 1280 2
LINE Normal -2240 1280 -2256 1296 2
LINE Normal 704 496 704 352 2
LINE Normal 704 496 704 496 2
LINE Normal 704 496 704 496 2
LINE Normal 688 480 704 496 2
LINE Normal 688 480 688 480 2
LINE Normal 720 480 704 496 2
LINE Normal -176 -720 -176 -864 2
LINE Normal -208 1120 -208 1120 2
LINE Normal -208 1120 -208 1120 2
LINE Normal -224 1104 -208 1120 2
LINE Normal -256 1104 -256 1104 2
LINE Normal -192 1104 -208 1120 2
LINE Normal -208 1120 -208 976 2
LINE Normal 320 496 320 496 2
LINE Normal 320 496 320 496 2
LINE Normal 304 480 304 480 2
LINE Normal 304 576 304 432 2
LINE Normal 304 576 304 576 2
LINE Normal 304 576 304 576 2
LINE Normal 288 560 304 576 2
LINE Normal 288 560 288 560 2
LINE Normal 320 560 304 576 2
LINE Normal 800 -512 944 -512 2
LINE Normal 800 -512 800 -512 2
LINE Normal 800 -512 800 -512 2
LINE Normal 816 -528 800 -512 2
LINE Normal 816 -528 816 -528 2
LINE Normal 816 -496 800 -512 2
LINE Normal 1008 656 864 656 2
LINE Normal 992 672 1008 656 2
LINE Normal 992 672 992 672 2
LINE Normal 992 640 1008 656 2
LINE Normal 1776 -1888 1776 -1744 2
LINE Normal 1776 -1888 1776 -1888 2
LINE Normal 1776 -1888 1776 -1888 2
LINE Normal 1792 -1872 1776 -1888 2
LINE Normal 1792 -1872 1792 -1872 2
LINE Normal 1760 -1872 1776 -1888 2
LINE Normal 1920 -1888 1920 -1744 2
LINE Normal 1920 -1888 1920 -1888 2
LINE Normal 1920 -1888 1920 -1888 2
LINE Normal 1936 -1872 1920 -1888 2
LINE Normal 1936 -1872 1936 -1872 2
LINE Normal 1904 -1872 1920 -1888 2
LINE Normal 2064 -1744 2064 -1888 2
LINE Normal 2064 -1744 2064 -1744 2
LINE Normal 2064 -1744 2064 -1744 2
LINE Normal 2048 -1760 2064 -1744 2
LINE Normal 2048 -1760 2048 -1760 2
LINE Normal 2080 -1760 2064 -1744 2
LINE Normal 2848 -1728 2848 -1872 2
LINE Normal 2848 -1728 2848 -1728 2
LINE Normal 2848 -1728 2848 -1728 2
LINE Normal 2832 -1744 2848 -1728 2
LINE Normal 2832 -1744 2832 -1744 2
LINE Normal 2864 -1744 2848 -1728 2
LINE Normal 2704 -1872 2704 -1728 2
LINE Normal 2704 -1872 2704 -1872 2
LINE Normal 2704 -1872 2704 -1872 2
LINE Normal 2720 -1856 2704 -1872 2
LINE Normal 2720 -1856 2720 -1856 2
LINE Normal 2688 -1856 2704 -1872 2
LINE Normal 2288 -1744 2288 -1888 2
LINE Normal 2288 -1744 2288 -1744 2
LINE Normal 2288 -1744 2288 -1744 2
LINE Normal 2272 -1760 2288 -1744 2
LINE Normal 2272 -1760 2272 -1760 2
LINE Normal 2304 -1760 2288 -1744 2
LINE Normal -2176 -256 -2176 -256 2
LINE Normal -2176 -256 -2176 -256 2
LINE Normal -2256 -544 -2256 -544 2
LINE Normal -2256 -544 -2256 -544 2
LINE Normal -2256 -480 -2256 -480 2
LINE Normal -2256 -480 -2256 -480 2
LINE Normal -2176 512 -2176 512 2
LINE Normal -2176 512 -2176 512 2
LINE Normal -2256 288 -2256 288 2
LINE Normal -2256 288 -2256 288 2
LINE Normal -2176 496 -2176 496 2
LINE Normal -2176 496 -2176 496 2
LINE Normal -128 848 -128 848 2
LINE Normal -128 848 -128 848 2
LINE Normal -144 832 -128 848 2
LINE Normal -144 832 -144 832 2
LINE Normal -112 832 -128 848 2
LINE Normal -128 848 -128 704 2
LINE Normal -128 -480 -128 -480 2
LINE Normal -128 -480 -128 -480 2
LINE Normal -144 -496 -128 -480 2
LINE Normal -144 -496 -144 -496 2
LINE Normal -112 -496 -128 -480 2
LINE Normal -128 -480 -128 -624 2
LINE Normal -864 64 -864 -80 2
LINE Normal -864 64 -864 64 2
LINE Normal -864 64 -864 64 2
LINE Normal -880 48 -864 64 2
LINE Normal -880 48 -880 48 2
LINE Normal -848 48 -864 64 2
LINE Normal -864 -192 -864 -336 2
LINE Normal -864 -192 -864 -192 2
LINE Normal -864 -192 -864 -192 2
LINE Normal -880 -208 -864 -192 2
LINE Normal -880 -208 -880 -208 2
LINE Normal -848 -208 -864 -192 2
LINE Normal -864 608 -864 464 2
LINE Normal -864 608 -864 608 2
LINE Normal -864 608 -864 608 2
LINE Normal -880 592 -864 608 2
LINE Normal -880 592 -880 592 2
LINE Normal -848 592 -864 608 2
LINE Normal 0 400 0 400 2
LINE Normal 672 -144 672 -144 2
LINE Normal 480 592 480 592 2
LINE Normal 896 688 896 688 2
LINE Normal 896 688 896 688 2
LINE Normal 912 704 896 688 2
LINE Normal -576 1088 -576 1088 2
LINE Normal -576 1088 -576 1088 2
LINE Normal -592 1104 -592 1104 2
LINE Normal -1776 1312 -1776 1168 2
LINE Normal -1776 1312 -1776 1312 2
LINE Normal -1776 1312 -1776 1312 2
LINE Normal -1792 1296 -1776 1312 2
LINE Normal -1792 1296 -1792 1296 2
LINE Normal -1760 1296 -1776 1312 2
LINE Normal -2080 -1264 -2080 -1408 2
LINE Normal -2080 -1264 -2080 -1264 2
LINE Normal -2080 -1264 -2080 -1264 2
LINE Normal -2096 -1280 -2080 -1264 2
LINE Normal -2096 -1280 -2096 -1280 2
LINE Normal -2064 -1280 -2080 -1264 2
LINE Normal -2080 1536 -2080 1392 2
LINE Normal -2080 1536 -2080 1536 2
LINE Normal -2080 1536 -2080 1536 2
LINE Normal -2096 1520 -2080 1536 2
LINE Normal -2096 1520 -2096 1520 2
LINE Normal -2064 1520 -2080 1536 2
LINE Normal -160 -736 -176 -720 2
LINE Normal -880 -1056 -880 -1056 2
LINE Normal -880 -1056 -880 -1056 2
LINE Normal -896 -1072 -880 -1056 2
LINE Normal -992 -1072 -992 -1072 2
LINE Normal -880 -1056 -880 -1200 2
LINE Normal -864 -1072 -880 -1056 2
LINE Normal -912 1424 -912 1424 2
LINE Normal -912 1424 -912 1424 2
LINE Normal -928 1408 -912 1424 2
LINE Normal -1024 1408 -1024 1408 2
LINE Normal -912 1424 -912 1280 2
LINE Normal -896 1408 -912 1424 2
LINE Normal -288 -1152 -288 -1152 2
RECTANGLE Normal 2608 -848 2048 -1008
RECTANGLE Normal 2608 -672 2048 -832 3
RECTANGLE Normal 2960 -432 2624 -1008 2
RECTANGLE Normal 2608 -432 2048 -656 3
RECTANGLE Normal 2048 -224 2960 -416 3
RECTANGLE Normal -400 656 -1040 -400 3
RECTANGLE Normal 768 -1792 368 -2032 1
RECTANGLE Normal 2960 -1056 1584 -2032 4
RECTANGLE Normal 1552 -1424 912 -2032 2
RECTANGLE Normal 2016 -528 1584 -1040 3
ARC Normal 144 -368 288 -272 147 -366 240 -237 3
ARC Normal -608 -272 -464 464 -563 453 -565 -267 2
ARC Normal -304 -624 -384 -448 -344 -632 -348 -442 2
ARC Normal -544 -896 -464 -720 -500 -714 -504 -904 2
ARC Normal -592 944 -512 1120 -548 1126 -552 936 2
ARC Normal -304 704 -384 880 -344 696 -348 886 2
ARC Normal 256 544 160 672 254 547 125 624 3
ARC Normal -2192 -1168 -2288 -1008 -2265 -1165 -2286 -1010 2
ARC Normal -2208 -976 -2112 -816 -2114 -818 -2135 -973 2
ARC Normal -1824 -976 -1920 -816 -1897 -973 -1918 -818 2
ARC Normal -1952 -528 -1856 -368 -1858 -370 -1879 -525 2
ARC Normal -1952 576 -1856 736 -1858 734 -1879 579 2
ARC Normal -2160 -256 -2256 -96 -2233 -253 -2254 -98 2
ARC Normal -2160 -448 -2256 -288 -2233 -445 -2254 -290 2
ARC Normal -2160 320 -2256 480 -2233 323 -2254 478 2
ARC Normal -2160 496 -2256 656 -2233 499 -2254 654 2
ARC Normal -2192 1056 -2096 1216 -2098 1214 -2119 1059 2
ARC Normal -1856 1056 -1952 1216 -1929 1059 -1950 1214 2
ARC Normal -288 1072 -144 1216 -146 1214 -167 1059 2
ARC Normal -592 752 -512 928 -548 934 -552 744 2
ARC Normal -592 -720 -496 -560 -498 -562 -519 -717 2
ARC Normal -304 -1008 -112 -848 -114 -850 -135 -1005 2
ARC Normal 240 -448 336 -288 334 -290 313 -445 2
ARC Normal 720 -352 816 -192 814 -194 793 -349 2
ARC Normal 720 448 816 608 814 606 793 451 2
ARC Normal 272 512 368 672 366 670 345 515 2
ARC Normal 512 -288 656 -192 515 -286 608 -157 3
ARC Normal 624 432 528 576 622 435 493 528 3
ARC Normal 624 816 720 976 718 974 697 819 2
ARC Normal 448 800 544 960 542 958 521 803 2
ARC Normal 640 -704 736 -544 734 -546 713 -701 2
ARC Normal 464 -704 560 -544 558 -546 537 -701 2
ARC Normal 336 -784 432 -624 430 -626 409 -781 2
ARC Normal 336 896 432 1056 430 1054 409 899 2
ARC Normal 64 -112 -64 48 -41 -109 -62 46 2
ARC Normal 64 224 -64 384 -41 227 -62 382 2
ARC Normal 944 704 784 800 786 798 941 777 2
ARC Normal 912 -464 752 -368 754 -370 909 -391 2
ARC Normal -528 -1264 -128 -1056 -130 -1058 -151 -1261 2
ARC Normal -224 1264 -128 1424 -130 1422 -151 1267 2
ARC Normal -1952 -368 -1856 -208 -1858 -210 -1879 -365 2
ARC Normal -1952 416 -1856 576 -1858 574 -1879 419 2
ARC Normal -2288 1264 -2384 1424 -2361 1267 -2382 1422 2
ARC Normal -2288 1440 -2384 1600 -2361 1443 -2382 1598 2
ARC Normal -2176 -1344 -2272 -1184 -2249 -1341 -2270 -1186 2
ARC Normal -864 -1280 -1008 -720 -937 -1277 -1006 -722 2
ARC Normal -944 960 -1088 1520 -1017 963 -1086 1518 2
ARC Normal -640 -1312 -448 -1152 -450 -1154 -471 -1309 2
ARC Normal -640 -1136 -448 -976 -450 -978 -471 -1133 2
ARC Normal -656 1536 -464 1376 -487 1533 -466 1378 2
ARC Normal -656 1360 -464 1200 -487 1357 -466 1202 2

The netlist it stands for:
* amplifier_V2.0c.asc
Q7 +HV N005 EQ7 0 MJE340
R9 EQ7 MID_POS 100
D3 CQ15 N005 D1N4148
Q9 +HV BQ9 EQ9 0 MJE340
R3 EQ3 feedback 0.15
R11 N011 EQ9 100
R4 feedback EQ4 0.15
Q10 -HV BQ10 EQ10 0 MJE350
Q8 -HV N014 EQ8 0 MJE350
D4 N014 CQ16 D1N4148
D2 MID_NEG -LV MBR1645
R12 EQ10 N011 100
R2 MID_NEG EQ2 0.1
R6 MID_NEG EQ6 0.1
R5 EQ5 MID_POS 0.1
R1 EQ1 MID_POS 0.1
D1 +LV MID_POS MBR1645
Q22 VBEM2 N008 VBEMID 0 MJE350
Q21 VBEM1 N006 VBEMID 0 MJE340
R23 VBEM1 N006 499
R24 N008 VBEM2 499
R19 BQ9 VBEM1 100
R20 BQ10 VBEM2 100
Q15 CQ15 EQ17 EQ15 0 MJE350
Q16 CQ16 EQ18 EQ16 0 MJE340
Q20 0 NEG_DIFF_OUT EQ20 0 MMBTA42
RFB2 fin N010 1.30k
RFB1 feedback fin 35.7k
RIOF1 din 0 35.7k
Q19 0 POS_DIFF_OUT EQ19 0 MMBTA92
Q35 CQ35 din CQ37 0 MMPQ6700-NPN
Q33 +RLV fin CQ37 0 MMPQ6700-NPN
Q36 CQ36 din CQ38 0 MMPQ6700-PNP
Q34 -RLV fin CQ38 0 MMPQ6700-PNP
CC5 CQ15 POS_DIFF_OUT {CComp4}
CC6 CQ16 NEG_DIFF_OUT {CComp4}
R17 +HVF EQ15 68
R18 EQ16 -HVF 68
XQ5 +HV EQ7 EQ5 2SC5200  ; pins 2 1 3
XQ1 +HV EQ7 EQ1 2SC5200  ; pins 2 1 3
XQ3 MID_POS EQ9 EQ3 2SC5200  ; pins 2 1 3
XQ4 MID_NEG EQ10 EQ4 2SA1943  ; pins 2 1 3
XQ6 -HV EQ8 EQ6 2SA1943  ; pins 2 1 3
XQ2 -HV EQ8 EQ2 2SA1943  ; pins 2 1 3
R43 0 AD35 560
Q37 CQ37 AD35 EQ37 0 MMBTA42
R35 EQ37 -RLV 1.58k
Q38 CQ38 BQ36 EQ38 0 MMBTA92
R36 +RLV EQ38 1.62k
R44 BQ36 0 560
RL feedback 0 {RL}
CC4 N014 -HV {CComp3P}
CC3 +HV N005 {CComp3N}
VG in 0 SINE(0 {VPin} {freq} {startdelay}) AC {VPin}
CF5 +HV 0 100n
XDZ31 -RLV CD35 DI_BZX84C5V1  ; pins + -
XDZ32 BQ36 CD36 DI_BZX84C5V1  ; pins + -
CC7 feedback fin {CComp5}
XRVMV N008 N006 N008 Rtot=2k wiper=0.78
D36 +RLV CD36 D1N4148
D35 AD35 CD35 D1N4148
Q12 CQ12 N009 feedback 0 MMBTA92
Q11 CQ11 N007 feedback 0 MMBTA42
D5 BQ9 CQ11 D1N4148
R7 EQ3 N007 68
R8 EQ4 N009 68
D6 CQ12 BQ10 D1N4148
R13 MID_POS N007 22k
R14 N009 MID_NEG 22k
CF1 +HV 0 470µ
CF7 +LV 0 100n
CF3 +LV 0 470µ
CF8 -LV 0 100n
CF4 -LV 0 470µ
CF6 -HV 0 100n
CF2 -HV 0 470µ
CF33 +RLV 0 100n
CF31 +RLV 0 220µ
CF34 -RLV 0 100n
CF32 -RLV 0 220µ
CAF N010 0 1m
D33 N010 N012 D1N4148
D34 N012 0 D1N4148
D32 0 N013 D1N4148
D31 N013 N010 D1N4148
CAI din in 47µ
R10 MID_NEG EQ8 100
CC2 VBEM1 VBEM2 {CComp2}
VPHV N001 0 {PHV}
VPLV N002 0 {PLV}
VNHV N003 0 {NHV}
VNLV N004 0 {NLV}
VPRLV +RLV 0 {PRLV}
VNRLV -RLV 0 {NRLV}
Vripple4 -LV N004 PULSE({ripple_amp_L} 0 0 1m 9m 0 10m)
Vripple3 -HV N003 PULSE({ripple_amp_H} 0 0 1m 9m 0 10m)
Vripple1 N001 +HV PULSE({ripple_amp_H} 0 0 1m 9m 0 10m)
Vripple2 N002 +LV PULSE({ripple_amp_H} 0 0 1m 9m 0 10m)
DZ1 VBEM1 CQ15 D1N4371
DZ2 CQ16 VBEM2 D1N4371
CC1 EQ9 EQ10 {CComp1}
Q31 POS_DIFF_OUT +RLV CQ35 0 MMBTA42
R31 +HVF POS_DIFF_OUT 10k
Q32 NEG_DIFF_OUT -RLV CQ36 0 MMBTA92
R32 -HVF NEG_DIFF_OUT 10k
XDZ3 EQ19 EQ17 DI_BZX84C13  ; pins + -
XDZ4 EQ18 EQ20 DI_BZX84C13  ; pins + -
R21 +HVF EQ17 1k
R22 EQ18 -HVF 1k
R15 +HV +HVF 15
CF9 +HVF 0 220µ
R16 -HV -HVF 15
CF10 -HVF 0 220µ
CF11 +HVF 0 100n
CF12 -HVF 0 100n
.model D D
.lib standard.dio
.model NPN NPN
.model PNP PNP
.lib standard.bjt
.tran 0 20m 0m 0.001m
.param freq 10k
* .op
.fourier {freq} 30 -1 V(out)
.lib 2SA1302.lib
.lib 2SC3281.lib
.lib MBR1645.lib
.lib MJE340.lib
.lib MJE350.lib
.lib D1N4148.lib
* .ac dec 10000 0.01 10G
.param VPin=888m
.lib BZX84C5V1.lib
.lib MMBTA42.lib
.lib MMBTA92.lib
.lib MMPQ6700.lib
.option plotwinsize=0
.meas TRAN Vrms RMS V(out) FROM {startfour}
.meas TRAN Pout PARAM (Vrms*Vrms/{RL})
.option numdgt=9
.meas TRAN Vout_max MAX V(out)
.param RL=8
.meas TRAN PinPHV AVG (V(+HV)*(-I(VPHV)) + V(+RHV)*(-I(VPRHV)))
.meas TRAN PinPLV AVG (V(+LV)*(-I(VPLV)) + V(+RLV)*(-I(VPRLV)))
.meas TRAN PinNHV AVG (V(-HV)*(-I(VNHV)) + V(-RHV)*(-I(VNRHV)))
.meas TRAN PinNLV AVG (V(-LV)*(-I(VNLV)) + V(-RLV)*(-I(VNRLV)))
.meas TRAN Pin param (PinPHV + PinPLV + PinNHV + PinNLV )
.meas TRAN Eff param (Pout / Pin)
* Multiplicador de VBE
* Protección
.param CComp1=10n
.param CComp3N=68p
.param CComp4=68p
* Compensación
.param CComp3P=68p
.param CComp5=1.2p
.param PHV=+{HV} PLV=+{LV} NHV=-{HV}
.param HV={if {SUPMODE == 0, LINELEVEL*SQRT(2)*HTRAFOEFF - DIODESDROPH, PREGHLAB}}
.param LV={if {SUPMODE == 0, LINELEVEL*SQRT(2)*LTRAFOEFF - DIODESDROPL, PREGLLAB}}
.param RLV=9
.param ripple_amp_H={if {SUPMODE == 0, 2.21, 0}}
.param NLV=-{LV} PRLV={RLV} NRLV=-{RLV}
.param ripple_amp_L={if {SUPMODE == 0, 1.1, 0}}
.param HTRAFOEFF=36
.param LTRAFOEFF=12
.param LINELEVEL={NORMALLINELEVEL}
* Tensión de línea(220V):
* 180V a 240V => 0.8 a 1.1
.param DIODESDROPH={if {SUPMODE == 0, 1.1, 0}}
.param MAXLINELEVEL=1.1
.param MINLINELEVEL=0.8
.lib D1N4371.lib
.param CComp2=6.8n
.param VPin1W=141m
.param VPinABSMAX=1.0885
.param VPin5W=314.5m
.param VPin10W=444.5m
.param VPin45W=942.7m
.param VPin50W=993.71m
.param VPin30W=769.66m
.param VPin0.5W=99.4m
.param VPinMAX={VPin50W}
.param NORMALLINELEVEL=1
.param DIODESDROPL={if {SUPMODE == 0, 1.2, 0}}
.meas TRAN VCEQ1_max MAX V(+HV, EQ1)
.meas TRAN VCEQ2_max MAX -V(-HV, EQ2)
.meas TRAN VCEQ5_max MAX V(+HV, EQ5)
.meas TRAN VCEQ6_max MAX -V(-HV, EQ6)
.meas TRAN VCEQ3_max MAX V(MID_POS, EQ3)
.meas TRAN VCEQ4_max MAX -V(MID_NEG, EQ4)
.meas TRAN VCEQ7_max MAX V(+HV, EQ7)
.meas TRAN VCEQ8_max MAX -V(-HV, EQ8)
.meas TRAN VCEQ9_max MAX V(+HV, EQ9)
.meas TRAN VCEQ10_max MAX -V(-HV, EQ10)
.meas TRAN VCEQ11_max MAX V(CQ11, out)
.meas TRAN VCEQ12_max MAX -V(CQ12, out)
.meas TRAN VCEQ13_max MAX -V(CQ13, EQ13)
.meas TRAN VCEQ14_max MAX V(CQ14, EQ14)
.meas TRAN VCEQ15_max MAX -V(CQ15, EQ15)
.meas TRAN VCEQ16_max MAX V(CQ16, EQ16)
.meas TRAN VCEQ17_max MAX V(EQ17)
.meas TRAN VCEQ18_max MAX -V(EQ18)
.meas TRAN VCEQ19_max MAX V(VBEM1, VBEMID)
.meas TRAN VCEQ20_max MAX -V(VBEM2, VBEMID)
.meas TRAN VCEQ31_max MAX -V(CQ31, EQ31)
.meas TRAN VCEQ32_max MAX V(CQ32, EQ32)
.meas TRAN VCEQ33_max MAX V(CQ31, EQ33)
.meas TRAN VCEQ34_max MAX -V(CQ34, EQ34)
.meas TRAN VCEQ35_max MAX V(CQ35, EQ35)
.meas TRAN VCEQ36_max MAX -V(CQ36, EQ36)
* Diferencia de corrientes
* Diferencia de corrientes
.param VPinEmpty=0
.lib BZX84C13.lib
.param VPinABSMAXMLL=1.08
.param VPinABSMAX30V={VPin30W}
.lib BZX84C16.lib
.param VPin40W=888.8m
.param startdelay=0
.param SUPMODE=0
.param PREGHLAB=30
.param PREGLLAB=15
.param VPin35W=832.7m
.param startfour=1.5m
.lib 2SC5200.mod
.lib 2SA1943.mod
.backanno
.end